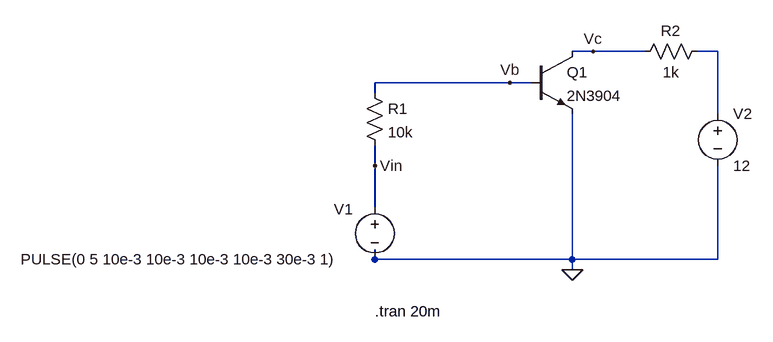
[diagram p0: schematic NPN.asc]
NPN.asc, the LTspice schematic file:
Version 4
SHEET 1 880 680
WIRE 272 80 240 80
WIRE 352 80 272 80
WIRE 464 80 432 80
WIRE 144 128 -64 128
WIRE 176 128 144 128
WIRE -64 144 -64 128
WIRE 464 176 464 80
WIRE -64 256 -64 224
WIRE -64 320 -64 256
WIRE -64 400 -64 384
WIRE 240 400 240 176
WIRE 240 400 -64 400
WIRE 464 400 464 256
WIRE 464 400 240 400
WIRE 240 416 240 400
WIRE 240 416 224 416
FLAG 240 416 0
FLAG 144 128 Vb
FLAG -64 256 Vin
FLAG 272 80 Vc
SYMBOL res -80 128 R0
SYMATTR InstName R1
SYMATTR Value 10k
SYMBOL res 448 64 R90
WINDOW 0 0 56 VBottom 2
WINDOW 3 32 56 VTop 2
SYMATTR InstName R2
SYMATTR Value 1k
SYMBOL voltage -64 304 R0
WINDOW 123 0 0 Left 0
WINDOW 39 0 0 Left 0
WINDOW 0 -63 19 Left 2
WINDOW 3 -545 96 Left 2
SYMATTR InstName V1
SYMATTR Value PULSE(0 5 10e-3 10e-3 10e-3 10e-3 30e-3 1)
SYMBOL voltage 464 160 R0
WINDOW 123 0 0 Left 0
WINDOW 39 0 0 Left 0
SYMATTR InstName V2
SYMATTR Value 12
SYMBOL npn 176 80 R0
SYMATTR InstName Q1
SYMATTR Value 2N3904
TEXT -64 480 Left 2 !.tran 20m

The netlist it stands for:
* NPN.asc
R1 Vb Vin 10k
R2 N001 Vc 1k
V1 Vin 0 PULSE(0 5 10e-3 10e-3 10e-3 10e-3 30e-3 1)
V2 N001 0 12
Q1 Vc Vb 0 0 2N3904
.model NPN NPN
.model PNP PNP
.lib standard.bjt
.tran 20m
.backanno
.end